# EAGLE schematic SistemRadio (EAGLE 9.7.0)
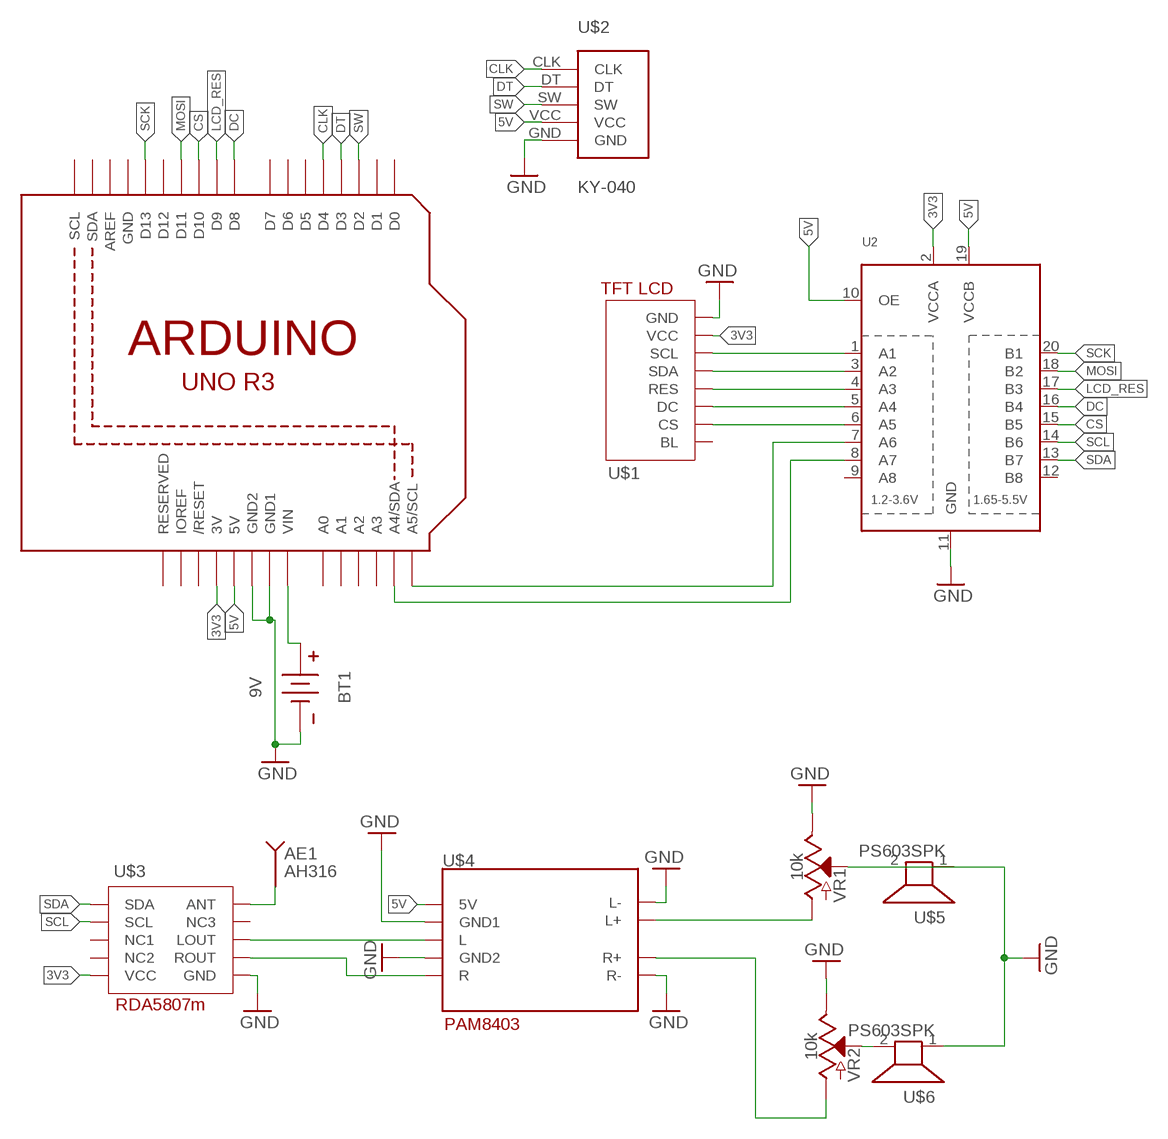
[diagram p0: schematic, sheet 1]

## Parts
AE1  AH316  [ANT-GPS-3.2X1MM]
BT1  9V  796136-1  [796136-1]
U1  ARDUINOR3-BPLACE  [ARDUINOR3-BPLACE]
U2  TXB0108PWR  [TSSOP20]
U$1  TFT_LCD  [TFT_LCD]
U$2  KY-040  [KY-040-PORT]
U$3  RDA5807M  [RDA5807M]
U$4  PAM8403  [PAM8403]
U$5  PS603SPK  [PS603]
U$6  PS603SPK  [PS603]
VR1  10k  POTENTIOMETER-PTH-9MM-1/20W-20%-KIT  [POT-PTH-ALPS-KIT]
VR2  10k  POTENTIOMETER-PTH-9MM-1/20W-20%-KIT  [POT-PTH-ALPS-KIT]

## Nets
3V3: U1.3V U2.2(VCCA) U$1.VCC U$3.VCC
5V: U1.5V U2.10(OE) U2.19(VCCB) U$2.VCC U$4.5V
CLK: U1.D4 U$2.CLK
CS: U1.D10 U2.6(A5) U$1.CS
DC: U1.D8 U2.5(A4) U$1.DC
DT: U1.D3 U$2.DT
GND: BT1.N(-) U1.GND1 U1.GND2 U2.11(GND) U$1.GND U$2.GND U$3.GND U$4.GND1 U$4.GND2 U$4.L- U$4.R- U$5.2 U$6.1 VR1.P$1(E) VR2.P$1(E)
LCD_RES: U1.D9 U2.4(A3) U$1.RES
MOSI: U1.D11 U2.3(A2) U$1.SDA
N$1: U2.20(B1)
N$2: U2.18(B2)
N$3: U$3.LOUT U$4.L
N$4: U$3.ROUT U$4.R
N$5: U2.17(B3)
N$6: U2.16(B4)
N$7: U2.15(B5)
N$8: U$4.L+ VR1.P$3(A)
N$9: U$4.R+ VR2.P$3(A)
N$10: U1.A5(A5/SCL) U2.7(A6)
N$11: U1.A4(A4/SDA) U2.8(A7)
N$12: U$5.1 VR1.P$2(S)
N$13: U$6.2 VR2.P$2(S)
N$22: AE1.2(GND) U$3.ANT
N$38: BT1.P(+) U1.VIN
SCK: U1.D13 U2.1(A1) U$1.SCL
SCL: U2.14(B6) U$3.SCL
SDA: U2.13(B7) U$3.SDA
SW: U1.D2 U$2.SW
Unconnected: AE1.1(SIG) U1.A0 U1.A1 U1.A2 U1.A3 U1.AREF U1.D0 U1.D1 U1.D5 U1.D6 U1.D7 U1.D12 U1.IOREF U1.RESERVED U1.RESET(/RESET) U1.SCL U1.SDA U2.9(A8) U2.12(B8) U$1.BL U$3.NC1 U$3.NC2 U$3.NC3

## Power pins joined to a net without a drawn wire
GND: U1.GND

## Library data of the parts
AE1 = RF_Wireless:AH: 2.4GHz Chip RF Antenna 2.4GHz - 2.5GHz Datasheet <https://www.yuden.co.jp/productdata/catalog/chipantenna01_e.pdf>; CATEGORY: Antenna; DESCRIPTION: Antenna SURF MOUNT ANTENNA RADIEDGE; MANUFACTURER: Taiyo Yuden; MPN: AH316M245001-T; OPERATING_TEMPERATURE: - 40 C to +85 C; ROHS_COMPLIANT: COMPLIANT; SERIES: AH; SUB_CATEGORY: Antenna; TYPE: 2.4GHz Antenna - 2.4GHz, 5GHz, Bluetooth, WiFi, WLAN, Zigbee
BT1 = Battery_Holder:796136-1: Battery Holder - Coin Cell SMD, 20.0mm Datasheet <https://www.te.com/commerce/DocumentDelivery/DDEController?Action=showdoc&DocId=Customer+Drawing%7F796136%7FG5%7Fpdf%7FEnglish%7FENG_CD_796136_G5.pdf%7F796136-1>; CATEGORY: Battery-Holder; MANUFACTURER: TE Connectivity AMP Connectors; MPN: 796136-1; PART_STATUS: ACTIVE; ROHS_COMPLIANCE: Compliant; SERIES: 2032; SUB_CATEGORY: Holder; TYPE: Coin Cell; VALUE: 796136-1
U1 = adafruit:ARDUINOR3: This is a new object for the new Arduino R3 - with extra pins that you may want to use (such as IOref, and duplicated A4/A5
U2 = adafruit:TXB0108PWR: 8-Bit Bi-Directional Level Shifter 1.2V-3.6V (VCCA) to 1.65V-5.5V (VCCB) bi-directional level shifter with auto direction sensing. Max data rate - VCCA 1.8V: 20Mbps (50ns), VCCA 3.3V: 100Mbps (10ns) Digikey: 296-21527-1-ND
U$1 = Proiect PM:TFT_LCD
U$2 = KY-040:KY-040: Check availability <https://pricing.snapeda.com/parts/KY-040/Joy-IT/view-part?ref=eda>; AVAILABILITY: Not in stock; CHECK_PRICES: https://www.snapeda.com/parts/KY-040/Joy-IT/view-part/?ref=eda; DESCRIPTION: KY-5.0-4P Green(RAL6018/T) ; CONTACT WITH TIN PLATED MARK; MF: Joy-IT; MP: KY-040; PACKAGE: Package; PRICE: None; SNAPEDA_LINK: https://www.snapeda.com/parts/KY-040/Joy-IT/view-part/?ref=snap
U$3 = Proiect PM:RDA5807M
U$4 = Proiect PM:PAM8403
U$5 U$6 = adafruit:PS603: PS603 Small 8 ohm speaker, from Mouser. Can SMT solder to board http://www.ladyada.net/library/pcb/eaglelibrary.html
VR1 VR2 = SparkFun-Resistors:POTENTIOMETER: Potentiometer (Pot) Three-terminal potentiometers, with an adjustable wiper and two adjustable resistors. A pot can be used to create a configurable voltage divider, or as a variable resistor. Variants ALPS_POT and ALPS_POT_KIT - PTH, breadboard compatible, 9mm square pots Rotary Potentiometer - Linear (10k ohm) <https://www.sparkfun.com/products/9288> (COM-09288) The KIT variant exposes copper on only one side of the PTH pad, so the part can only be assembled on one side of the PCB. Useful for beginner soldering kits.; PROD_ID: RES-09177; SF_SKU: COM-09288